# EAGLE design pc-bus (EAGLE 9.6.2)
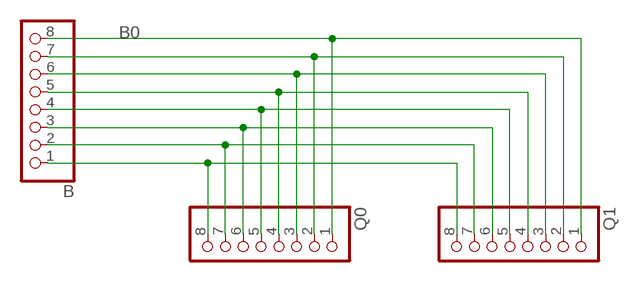
[diagram p0: schematic, sheet 1]

## Parts
B  PINHD-1X8  [1X08]
Q0  PINHD-1X8  [1X08]
Q1  PINHD-1X8  [1X08]

## Nets
B0: B.8 Q0.1 Q1.1
N$1: B.1 Q0.8 Q1.8
N$2: B.2 Q0.7 Q1.7
N$3: B.3 Q0.6 Q1.6
N$4: B.4 Q0.5 Q1.5
N$5: B.5 Q0.4 Q1.4
N$6: B.6 Q0.3 Q1.3
N$7: B.7 Q0.2 Q1.2

## Library data of the parts
B Q0 Q1 = pinhead:PINHD-1X8: PIN HEADER

## Board
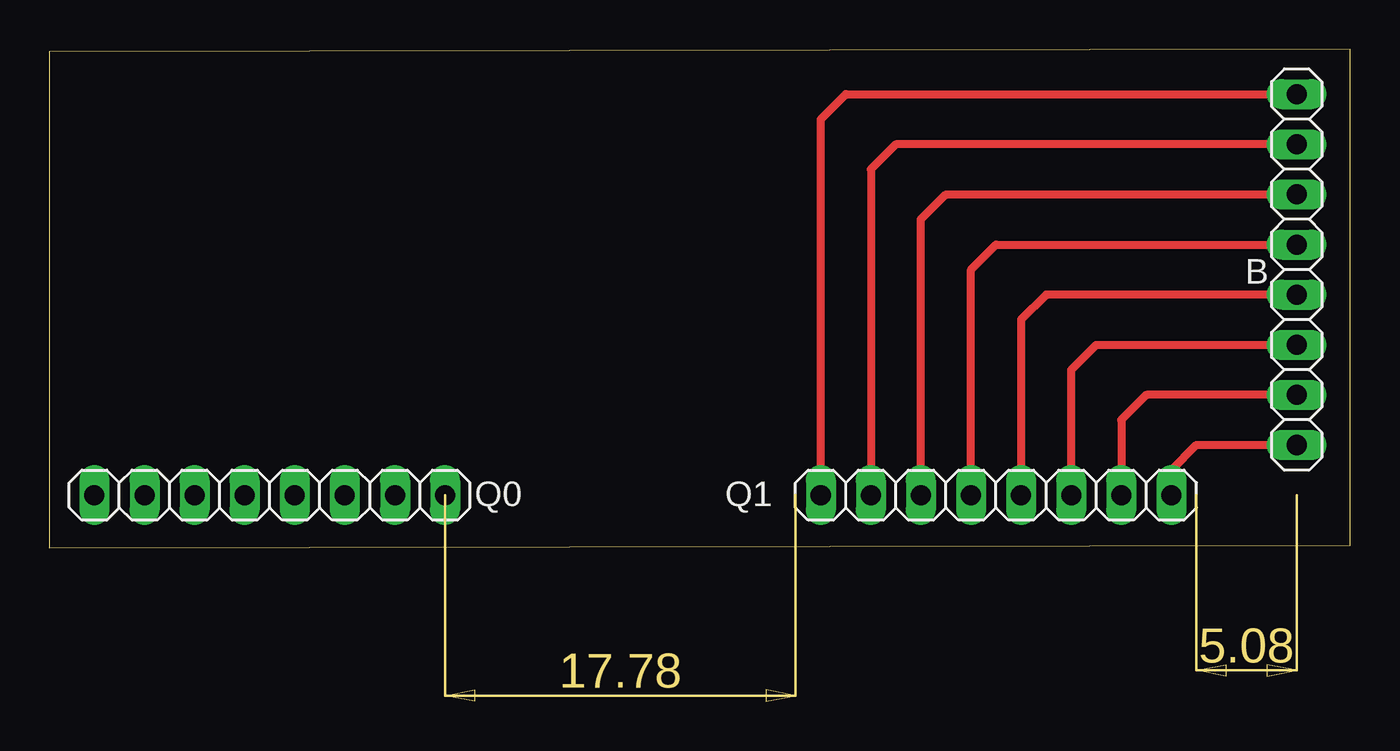
[diagram p1: board, top side]
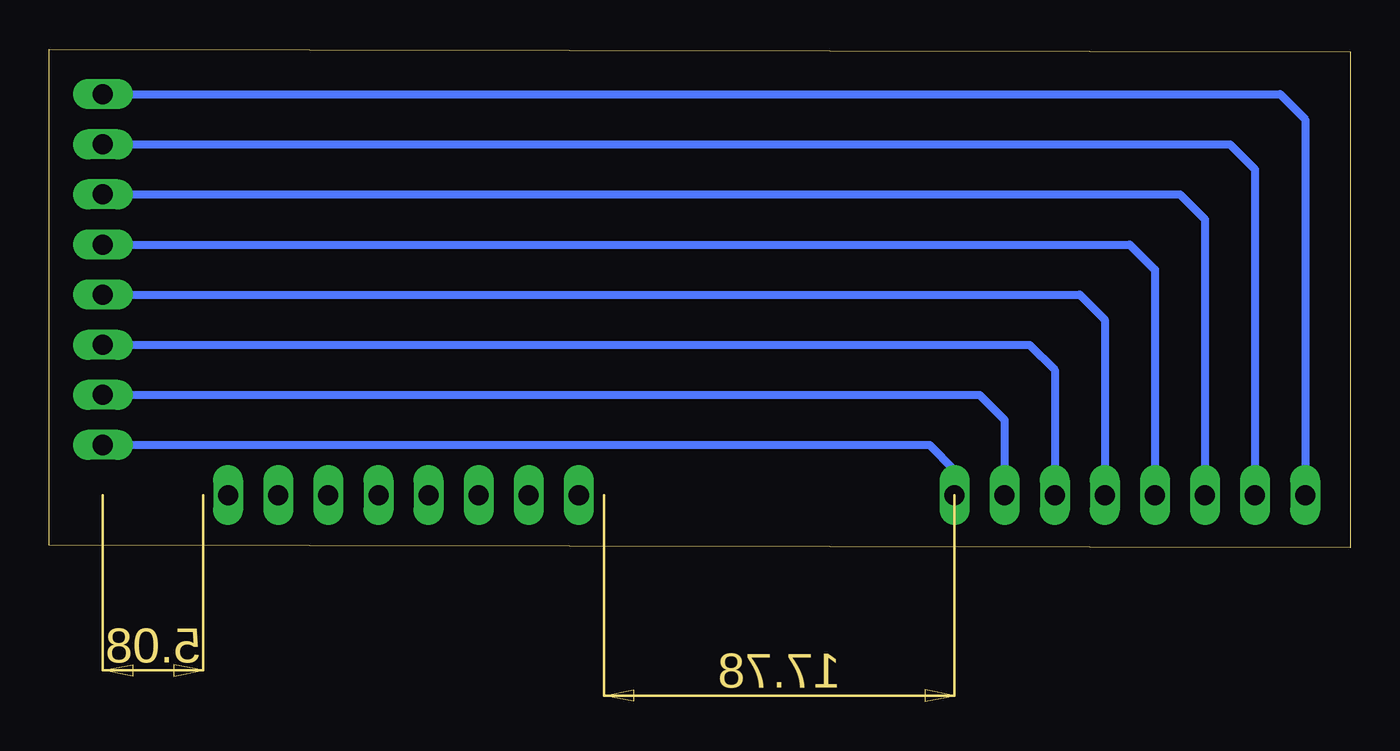
[diagram p2: board, bottom side, seen from below]

Size 65.96 x 25.26 mm. Coordinates in mm from the lower left corner, seen from the top.
Outline: 0,0 65.96,0.13 65.96,25.26 0,25.14 0,0
Copper layers (1*16): Top 0.035mm / dielectric 1.5mm / Bottom 0.035mm
Design rules "default": minimum track width 6mil, minimum drill 0.35mm, track to track 6mil, track to pad 6mil, pad to pad 6mil, via to via 6mil, smd to smd 6mil, copper to edge 40mil, drill to drill 6mil, minimum pad ring 10mil, minimum via ring 8mil, stop-mask expansion 4mil, vias tented up to drill 0mil, thermal gap 10mil

### Footprints (pad centres in the part's own frame; a part is rotated, then mirrored left to right if it is on the bottom)
1X08 = drill 1.016 long: 1 -8.89,0; 2 -6.35,0; 3 -3.81,0; 4 -1.27,0; 5 1.27,0; 6 3.81,0; 7 6.35,0; 8 8.89,0

### Placement (x,y rotation side)
B  63.25,14.1 270 top
Q0  11.18,2.67 180 top
Q1  48.01,2.67 180 top

### Tracks (layer width: path | path; a pad name or v marks a point on that pad's centre or on a via)
B0
  Top 0.4: Q1.1 56.9,3.94 58.17,5.21 B.8
  Bottom 0.4: B.8 21.34,5.21 20.07,3.94 Q0.1
N$1
  Top 0.4: Q1.8 39.12,21.72 40.39,22.99 B.1
  Bottom 0.4: B.1 3.56,22.99 2.29,21.72 Q0.8
N$2
  Top 0.4: B.2 42.93,20.45 41.66,19.18 Q1.7
  Bottom 0.4: B.2 6.1,20.45 4.83,19.18 Q0.7
N$3
  Top 0.4: Q1.6 44.2,16.64 45.47,17.91 B.3
  Bottom 0.4: B.3 8.64,17.91 7.37,16.64 Q0.6
N$4
  Top 0.4: Q1.5 46.74,14.1 48.01,15.37 B.4
  Bottom 0.4: B.4 11.18,15.37 9.91,14.1 Q0.5
N$5
  Top 0.4: B.5 50.55,12.83 49.28,11.56 Q1.4
  Bottom 0.4: B.5 13.72,12.83 12.45,11.56 Q0.4
N$6
  Top 0.4: Q1.3 51.82,9.02 53.09,10.29 B.6
  Bottom 0.4: Q0.3 14.99,9.02 16.26,10.29 B.6
N$7
  Top 0.4: B.7 55.63,7.75 54.36,6.48 Q1.2
  Bottom 0.4: B.7 18.8,7.75 17.53,6.48 Q0.2